# EAGLE schematic isolation (EAGLE 7.5.0)
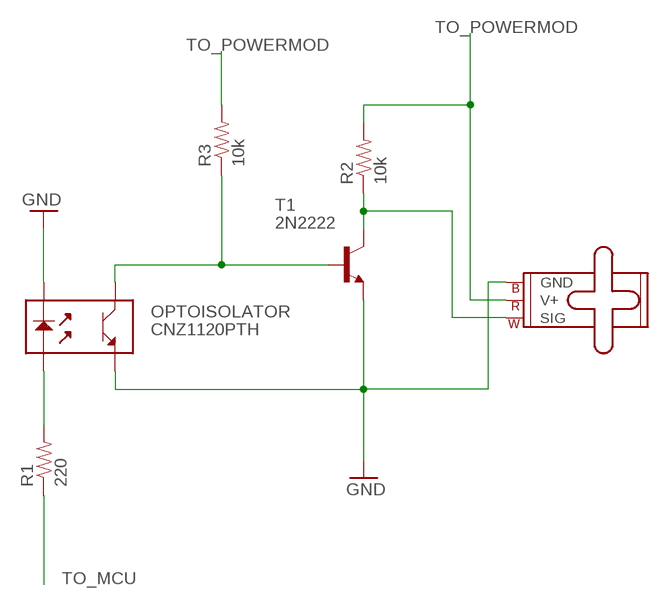
[diagram p0: schematic, sheet 1]

## Parts
M1  SMALL_SERVO  [1X03]
OPTOISOLATOR  CNZ1120PTH  [CNZ1120]
R1  220  RESISTOREZ  [AXIAL-0.3EZ]
R2  10k  RESISTOREZ  [AXIAL-0.3EZ]
R3  10k  RESISTOREZ  [AXIAL-0.3EZ]
T1  2N2222  [TO92-EBC-OVAL]

## Nets
GND: M1.3(GND) OPTOISOLATOR.2 OPTOISOLATOR.4 T1.E
N$1: OPTOISOLATOR.1 R1.P$2
N$2: M1.1(SIG) R2.P$1 T1.C
N$3: OPTOISOLATOR.3 R3.P$1 T1.B
TO_MCU: R1.P$1
TO_POWERMOD: M1.2(V+) R2.P$2 R3.P$2

## Library data of the parts
M1 = SparkFun-Electromechanical:SMALL_SERVO: Small servo motor This is the small servo used in the SIK. SKU: ROB-09065
OPTOISOLATOR = SparkFun-DiscreteSemi:CNZ1120: LED-to-NPN optoisolator
R1-R3 = SparkFun-Passives:RESISTOR: Resistor Basic schematic elements and footprints for 0603, 1206, and PTH resistors.
T1 = adafruit:2N2222: NPN TRANSISTOR Big oval pads